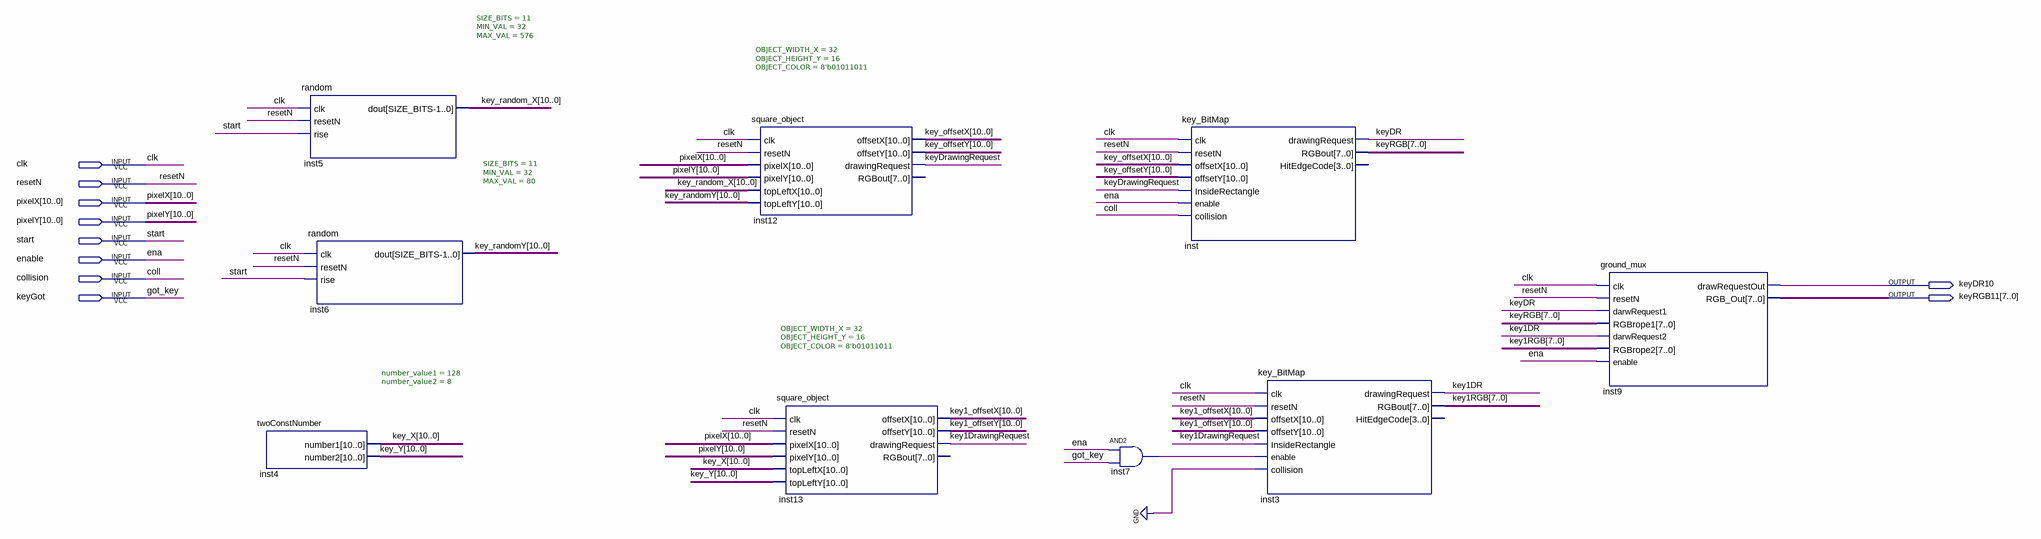
[diagram p0: schematic sheet]
// Quartus schematic keyBlock.bdf as structural Verilog: 9 symbols, 10 pins
module keyBlock (
  input  clk,
  input  resetN,
  input  [10:0] pixelX,
  input  [10:0] pixelY,
  input  start,
  input  enable,
  input  collision,
  input  keyGot,
  output keyDR10,
  output [7:0] keyRGB11
);

  wire inst7_out, key1DR, key1DrawingRequest, keyDR, keyDrawingRequest;
  wire [7:0] key1RGB, keyRGB;
  wire [10:0] key1_offsetX, key1_offsetY, key_offsetX, key_offsetY, key_random_X, key_randomY, key_X, key_Y;

  twoConstNumber #(.number_value1(128), .number_value2(8)) inst4 (.number1(key_X), .number2(key_Y));
  random #(.SIZE_BITS(11), .MIN_VAL(32), .MAX_VAL(576)) inst5 (
    .clk(clk), .resetN(resetN), .rise(start), .dout(key_random_X));
  random #(.SIZE_BITS(11), .MIN_VAL(32), .MAX_VAL(80)) inst6 (
    .clk(clk), .resetN(resetN), .rise(start), .dout(key_randomY));
  square_object #(.OBJECT_WIDTH_X(32), .OBJECT_HEIGHT_Y(16), .OBJECT_COLOR(8'b01011011)) inst12 (
    .clk(clk), .resetN(resetN), .pixelX(pixelX), .pixelY(pixelY), .topLeftX(key_random_X),
    .topLeftY(key_randomY), .offsetX(key_offsetX), .offsetY(key_offsetY), .drawingRequest(keyDrawingRequest));  // open: RGBout
  square_object #(.OBJECT_WIDTH_X(32), .OBJECT_HEIGHT_Y(16), .OBJECT_COLOR(8'b01011011)) inst13 (
    .clk(clk), .resetN(resetN), .pixelX(pixelX), .pixelY(pixelY), .topLeftX(key_X), .topLeftY(key_Y),
    .offsetX(key1_offsetX), .offsetY(key1_offsetY), .drawingRequest(key1DrawingRequest));  // open: RGBout
  and inst7 (inst7_out, enable, keyGot);
  key_BitMap inst (
    .clk(clk), .resetN(resetN), .offsetX(key_offsetX), .offsetY(key_offsetY),
    .InsideRectangle(keyDrawingRequest), .enable(enable), .collision(collision), .drawingRequest(keyDR),
    .RGBout(keyRGB));  // open: HitEdgeCode
  key_BitMap inst3 (
    .clk(clk), .resetN(resetN), .offsetX(key1_offsetX), .offsetY(key1_offsetY),
    .InsideRectangle(key1DrawingRequest), .enable(inst7_out), .collision(1'b0), .drawingRequest(key1DR),
    .RGBout(key1RGB));  // open: HitEdgeCode
  ground_mux inst9 (
    .clk(clk), .resetN(resetN), .darwRequest1(keyDR), .RGBrope1(keyRGB), .darwRequest2(key1DR),
    .RGBrope2(key1RGB), .enable(enable), .drawRequestOut(keyDR10), .RGB_Out(keyRGB11));

  // Other names for the same wires on the sheet: coll = collision; ena = enable; got_key = keyGot
endmodule
